# Altium schematic sheet SPI Buffer.SchDoc: Flash memory
size A4; Author: Michał Gumiela; DocumentNumber: 14; SheetNumber: 14; SheetTotal: 16; Model: EM1; PageSetup: Record=PageOptions|CenterHorizontal=True|CenterVertical=True|PrintScale=0.52|XCorrection=1.00|YCorrection=1.00|PrintKind=1|BorderSize=5000000|LeftOffset=0|BottomOffset=0|Orientation=2|PaperLength=4200|PaperWidth=2970|Scale=100|PaperSource=7|PrintQuality=600|MediaType=1|DitherType=10|PaperKind=A3|PrintScaleMode=1
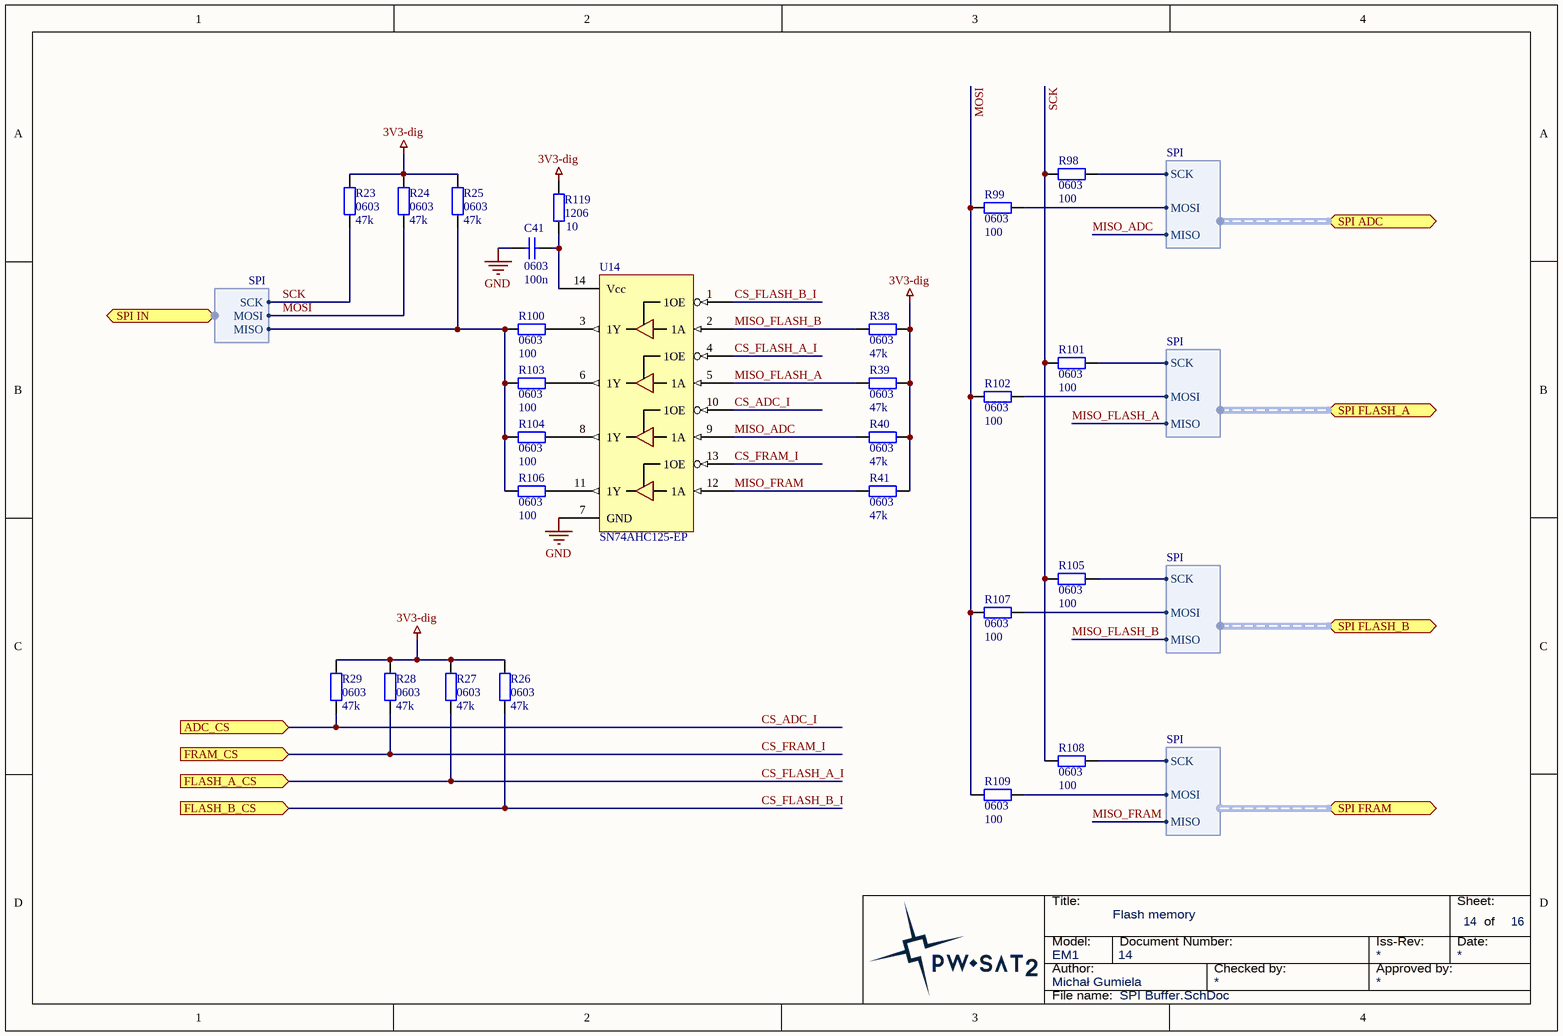
[diagram p0: SPI Buffer.SchDoc]

## Parts
C41  0603  value 100n  [SMD_Capacitor_0603]
R23  0603  value 47k  [SMD_Resistor_0603]
R24  0603  value 47k  [SMD_Resistor_0603]
R25  0603  value 47k  [SMD_Resistor_0603]
R26  0603  value 47k  [SMD_Resistor_0603]
R27  0603  value 47k  [SMD_Resistor_0603]
R28  0603  value 47k  [SMD_Resistor_0603]
R29  0603  value 47k  [SMD_Resistor_0603]
R38  0603  value 47k  [SMD_Resistor_0603]
R39  0603  value 47k  [SMD_Resistor_0603]
R40  0603  value 47k  [SMD_Resistor_0603]
R41  0603  value 47k  [SMD_Resistor_0603]
R98  0603  value 100  [SMD_Resistor_0603]
R99  0603  value 100  [SMD_Resistor_0603]
R100  0603  value 100  [SMD_Resistor_0603]
R101  0603  value 100  [SMD_Resistor_0603]
R102  0603  value 100  [SMD_Resistor_0603]
R103  0603  value 100  [SMD_Resistor_0603]
R104  0603  value 100  [SMD_Resistor_0603]
R105  0603  value 100  [SMD_Resistor_0603]
R106  0603  value 100  [SMD_Resistor_0603]
R107  0603  value 100  [SMD_Resistor_0603]
R108  0603  value 100  [SMD_Resistor_0603]
R109  0603  value 100  [SMD_Resistor_0603]
R119  1206  value 10  [SMD_Resistor_1206]
U14  SN74AHC125-EP  [TSSOP14_L]

## Ports
ADC_CS (in), FLASH_A_CS (in), FLASH_B_CS (in), FRAM_CS (in), SPI ADC (harness SPI), SPI FLASH_A (harness SPI), SPI FLASH_B (harness SPI), SPI FRAM (harness SPI), SPI IN (harness SPI)

## Harnesses
SPI: MOSI, MISO, SCK

## Nets
3V3-dig: R23.2 R24.2 R25.2 R26.2 R27.2 R28.2 R29.2 R38.1 R39.1 R40.1 R41.1 R119.1
GND: C41.2 U14.7(GND)
CS_ADC_I: R29.1 U14.10(1OE) ; port ADC_CS
CS_FLASH_A_I: R27.1 U14.4(1OE) ; port FLASH_A_CS
CS_FLASH_B_I: R26.1 U14.1(1OE) ; port FLASH_B_CS
CS_FRAM_I: R28.1 U14.13(1OE) ; port FRAM_CS
MISO_ADC: R40.2 U14.9(1A) ; port SPI ADC.MISO
MISO_FLASH_A: R39.2 U14.5(1A) ; port SPI FLASH_A.MISO
MISO_FLASH_B: R38.2 U14.2(1A) ; port SPI FLASH_B.MISO
MISO_FRAM: R41.2 U14.12(1A) ; port SPI FRAM.MISO
MOSI: R24.1 R99.1 R102.1 R107.1 R109.1 ; port SPI IN.MOSI
SCK: R23.1 R98.1 R101.1 R105.1 R108.1 ; port SPI IN.SCK
NetC41_1: C41.1 R119.2 U14.14(Vcc)
NetR25_1: R25.1 R100.1 R103.1 R104.1 R106.1 ; port SPI IN.MISO
NetR98_2: R98.2 ; port SPI ADC.SCK
NetR99_2: R99.2 ; port SPI ADC.MOSI
NetR100_2: R100.2 U14.3(1Y)
NetR101_2: R101.2 ; port SPI FLASH_A.SCK
NetR102_2: R102.2 ; port SPI FLASH_A.MOSI
NetR103_2: R103.2 U14.6(1Y)
NetR104_2: R104.2 U14.8(1Y)
NetR105_2: R105.2 ; port SPI FLASH_B.SCK
NetR106_2: R106.2 U14.11(1Y)
NetR107_2: R107.2 ; port SPI FLASH_B.MOSI
NetR108_2: R108.2 ; port SPI FRAM.SCK
NetR109_2: R109.2 ; port SPI FRAM.MOSI

## Notes on the sheet
- Title:
- Sheet:
- of
- Author:
- Model:
- Document Number:
- Checked by:
- Iss-Rev:
- Approved by:
- Date:
- File name:

## Library data of the parts
C41 = Cap1: Capacitor; Published: 8-Jun-2000; LatestRevisionDate: 17-Jul-2002; LatestRevisionNote: Re-released for DXP Platform.; PackageReference: RAD-0.3; Publisher: Altium Limited; PackageDescription: Radial Cap, Thru-Hole; 2 Leads; 0.3 in Pin Spacing
R23-R29 R38-R41 R98-R109 R119 = Res2: Resistor; Published: 8-Jun-2000; LatestRevisionDate: 17-Jul-2002; LatestRevisionNote: Re-released for DXP Platform.; PackageReference: AXIAL-0.4; Publisher: Altium Limited; PackageDescription: Axial Device, Thru-Hole; 2 Leads; 0.4 in Pin Spacing
U14 = SN74AHC125-EP: QUADRUPLE BUS BUFFER GATE  WITH 3-STATE OUTPUTS